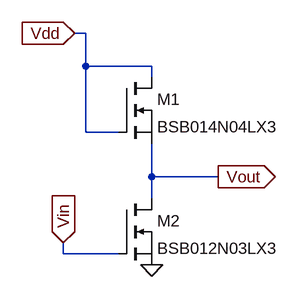
[diagram p0: schematic Inverter.asc]
Inverter.asc, the LTspice schematic file:
Version 4
SHEET 1 880 680
WIRE 96 -224 80 -224
WIRE 96 -176 96 -224
WIRE 192 -176 96 -176
WIRE 192 -160 192 -176
WIRE 96 -80 96 -176
WIRE 144 -80 96 -80
WIRE 192 -16 192 -64
WIRE 288 -16 192 -16
WIRE 192 16 192 -16
WIRE 64 96 64 80
WIRE 144 96 64 96
FLAG 192 112 0
FLAG 80 -224 Vdd
IOPIN 80 -224 In
FLAG 288 -16 Vout
IOPIN 288 -16 Out
FLAG 64 80 Vin
IOPIN 64 80 In
SYMBOL nmos 144 -160 R0
SYMATTR InstName M1
SYMATTR Value BSB014N04LX3
SYMBOL nmos 144 16 R0
SYMATTR InstName M2
SYMATTR Value BSB012N03LX3

The netlist it stands for:
* Inverter.asc
M1 Vdd Vdd Vout Vout BSB014N04LX3
M2 Vout Vin 0 0 BSB012N03LX3
.model NMOS NMOS
.model PMOS PMOS
.lib standard.mos
.backanno
.end